# EAGLE schematic display_driver (EAGLE 7.1.0)
REVISION: v0.1
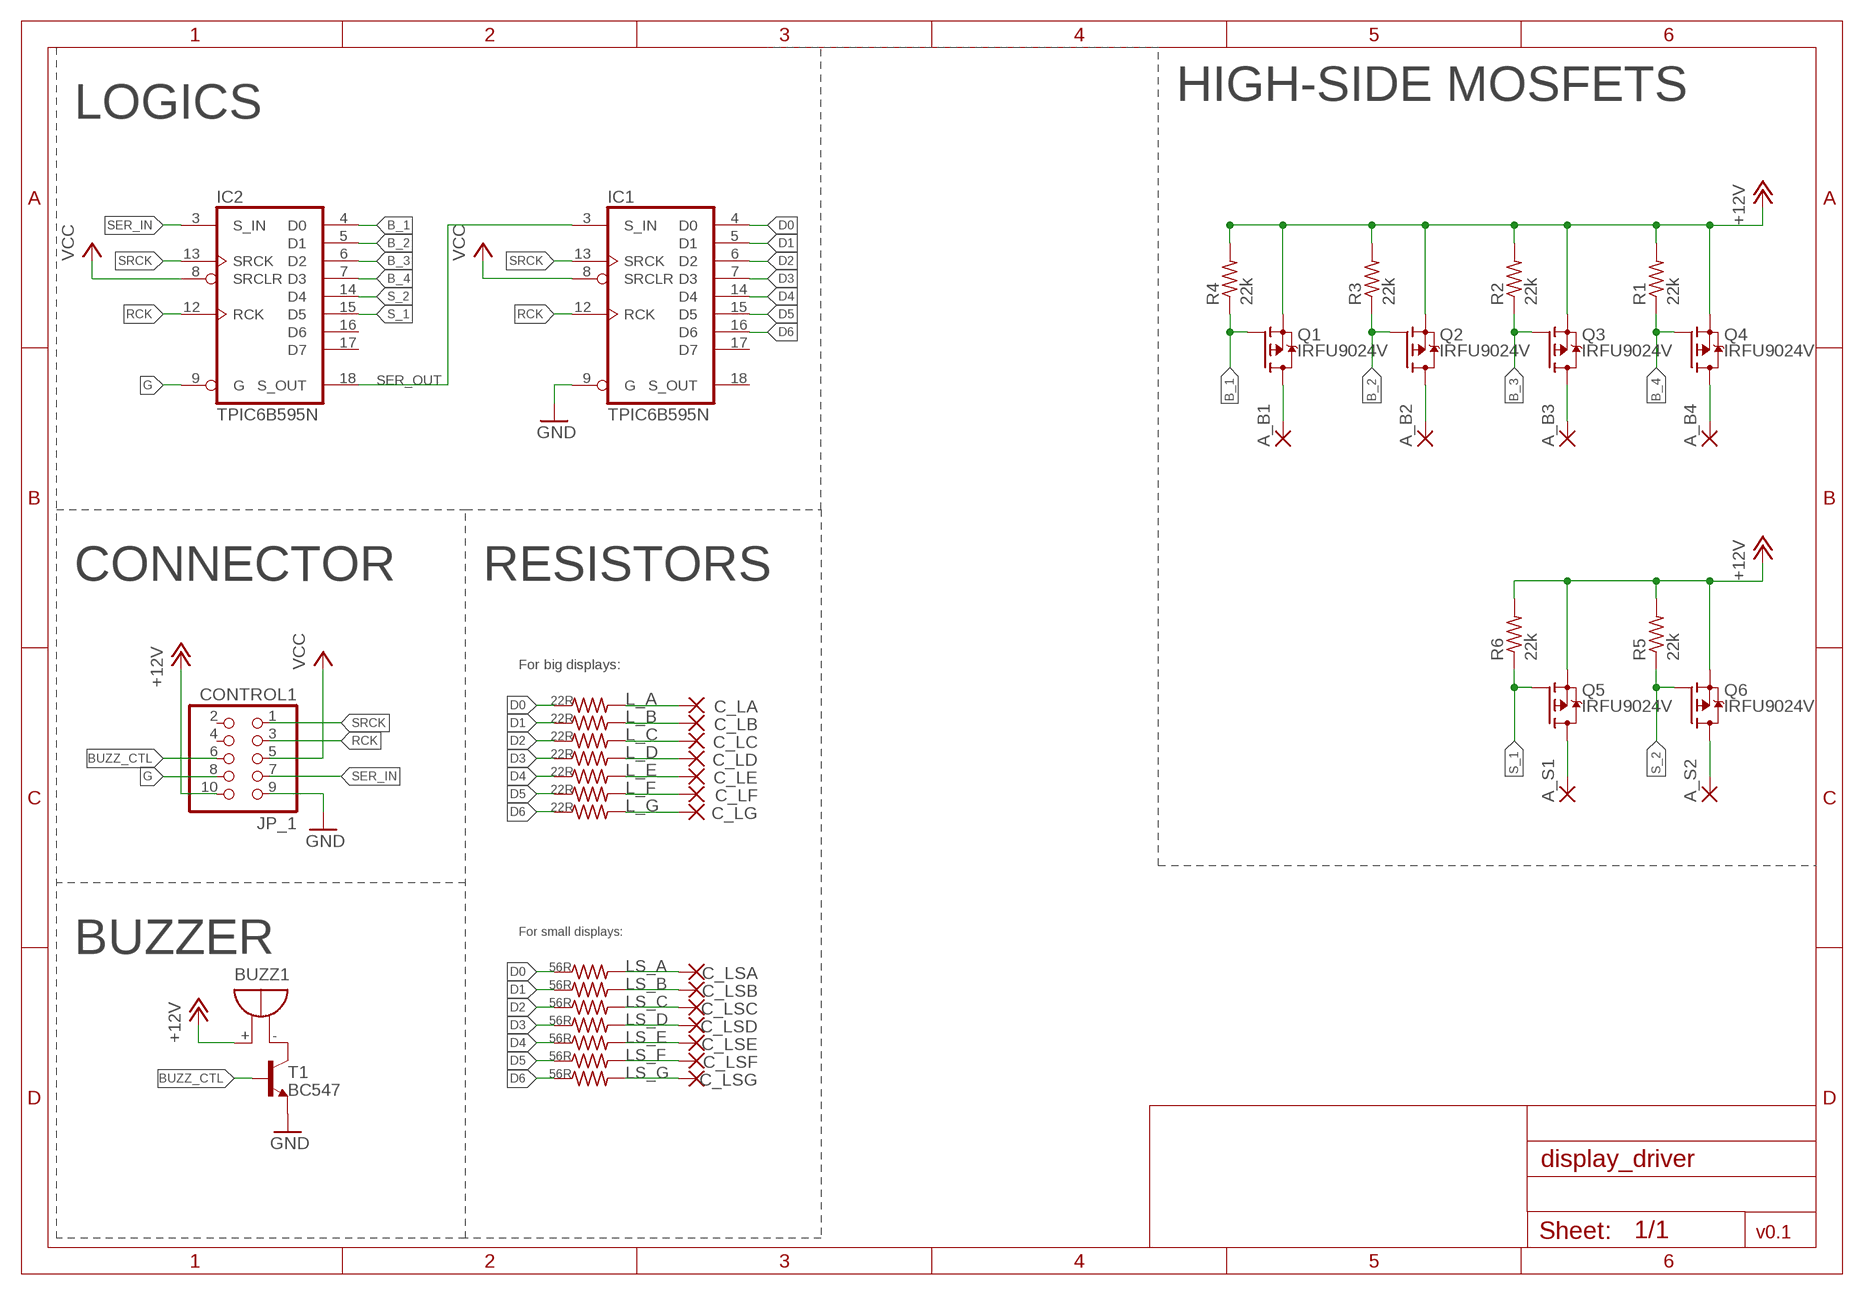
[diagram p0: schematic, sheet 1]

## Parts
A_B1  1,6/0,9  [1,6/0,9]
A_B2  1,6/0,9  [1,6/0,9]
A_B3  1,6/0,9  [1,6/0,9]
A_B4  1,6/0,9  [1,6/0,9]
A_S1  1,6/0,9  [1,6/0,9]
A_S2  1,6/0,9  [1,6/0,9]
BUZZ1  F/BC40  [F/BC40]
C_LA  1,6/0,9  [1,6/0,9]
C_LB  1,6/0,9  [1,6/0,9]
C_LC  1,6/0,9  [1,6/0,9]
C_LD  1,6/0,9  [1,6/0,9]
C_LE  1,6/0,9  [1,6/0,9]
C_LF  1,6/0,9  [1,6/0,9]
C_LG  1,6/0,9  [1,6/0,9]
C_LSA  1,6/0,9  [1,6/0,9]
C_LSB  1,6/0,9  [1,6/0,9]
C_LSC  1,6/0,9  [1,6/0,9]
C_LSD  1,6/0,9  [1,6/0,9]
C_LSE  1,6/0,9  [1,6/0,9]
C_LSF  1,6/0,9  [1,6/0,9]
C_LSG  1,6/0,9  [1,6/0,9]
CONTROL1  JP_1  PINHD-2X5  [2X05]
IC1  TPIC6B595N  [DIL20]
IC2  TPIC6B595N  [DIL20]
Q1  IRFU9024V  [TO251AA-V]
Q2  IRFU9024V  [TO251AA-V]
Q3  IRFU9024V  [TO251AA-V]
Q4  IRFU9024V  [TO251AA-V]
Q5  IRFU9024V  [TO251AA-V]
Q6  IRFU9024V  [TO251AA-V]
R1  22k  R-US_0204/5  [0204/5]
R2  22k  R-US_0204/5  [0204/5]
R3  22k  R-US_0204/5  [0204/5]
R4  22k  R-US_0204/5  [0204/5]
R5  22k  R-US_0204/5  [0204/5]
R6  22k  R-US_0204/5  [0204/5]
R7  22R  R-US_0207/12  [0207/12]
R8  22R  R-US_0207/12  [0207/12]
R9  22R  R-US_0207/12  [0207/12]
R10  22R  R-US_0207/12  [0207/12]
R11  22R  R-US_0207/12  [0207/12]
R12  22R  R-US_0207/12  [0207/12]
R13  22R  R-US_0207/12  [0207/12]
R14  56R  R-US_0207/10  [0207/10]
R15  56R  R-US_0207/10  [0207/10]
R16  56R  R-US_0207/10  [0207/10]
R17  56R  R-US_0207/10  [0207/10]
R18  56R  R-US_0207/10  [0207/10]
R19  56R  R-US_0207/10  [0207/10]
R20  56R  R-US_0207/10  [0207/10]
T1  BC547  [TO92]

## Nets
+12V: BUZZ1.+ CONTROL1.10 Q1.3(S) Q2.3(S) Q3.3(S) Q4.3(S) Q5.3(S) Q6.3(S) R1.2 R2.2 R3.2 R4.2 R5.2 R6.2
B_1: IC2.4(D0) Q1.1(G) R4.1
B_2: IC2.5(D1) Q2.1(G) R3.1
B_3: IC2.6(D2) Q3.1(G) R2.1
B_4: IC2.7(D3) Q4.1(G) R1.1
BUZZ_CTL: CONTROL1.6 T1.2(B)
D0: IC1.4(D0) R7.1 R14.1
D1: IC1.5(D1) R8.1 R15.1
D2: IC1.6(D2) R9.1 R16.1
D3: IC1.7(D3) R10.1 R17.1
D4: IC1.14(D4) R11.1 R18.1
D5: IC1.15(D5) R12.1 R19.1
D6: IC1.16(D6) R13.1 R20.1
G: CONTROL1.8 IC2.9(G)
GND: CONTROL1.9 IC1.9(G) T1.1(E)
L_A: C_LA.1(P) R7.2
L_B: C_LB.1(P) R8.2
L_C: C_LC.1(P) R9.2
L_D: C_LD.1(P) R10.2
L_E: C_LE.1(P) R11.2
L_F: C_LF.1(P) R12.2
L_G: C_LG.1(P) R13.2
LS_A: C_LSA.1(P) R14.2
LS_B: C_LSB.1(P) R15.2
LS_C: C_LSC.1(P) R16.2
LS_D: C_LSD.1(P) R17.2
LS_E: C_LSE.1(P) R18.2
LS_F: C_LSF.1(P) R19.2
LS_G: C_LSG.1(P) R20.2
N$1: A_B1.1(P) Q1.2(D)
N$2: BUZZ1.- T1.3(C)
N$4: A_B2.1(P) Q2.2(D)
N$9: A_B3.1(P) Q3.2(D)
N$12: A_B4.1(P) Q4.2(D)
N$42: A_S2.1(P) Q6.2(D)
N$47: A_S1.1(P) Q5.2(D)
RCK: CONTROL1.3 IC1.12(RCK) IC2.12(RCK)
S_1: IC2.15(D5) Q5.1(G) R6.1
S_2: IC2.14(D4) Q6.1(G) R5.1
SER_IN: CONTROL1.7 IC2.3(S_IN)
SER_OUT: IC1.3(S_IN) IC2.18(S_OUT)
SRCK: CONTROL1.1 IC1.13(SRCK) IC2.13(SRCK)
VCC: CONTROL1.5 IC1.8(SRCLR) IC2.8(SRCLR)
Unconnected: CONTROL1.2 CONTROL1.4 IC1.17(D7) IC1.18(S_OUT) IC2.16(D6) IC2.17(D7)

## Notes on the sheet
- HIGH-SIDE MOSFETS
- LOGICS
- CONNECTOR | RESISTORS
- For big displays:
- For small displays:
- BUZZER

## Power pins joined to a net without a drawn wire
GND: IC1.10(GND) IC1.11(GND) IC1.19(GND) IC2.10(GND) IC2.11(GND) IC2.19(GND)
VCC: IC1.2(VCC) IC2.2(VCC)

## Library data of the parts
A_B1-A_B4 A_S1 A_S2 C_LA C_LB C_LC C_LD C_LE C_LF C_LG C_LSA C_LSB C_LSC C_LSD C_LSE C_LSF C_LSG = wirepad:1,6/0,9: THROUGH-HOLE PAD
BUZZ1 = buzzer:F/BC40: BUZZER Source: Spoerle; OC_FARNELL: unknown; OC_NEWARK: unknown
CONTROL1 = pinhead:PINHD-2X5: PIN HEADER
IC1 IC2 = NumericDisplay:TPIC6B595: 8-bit SHIFT REGISTER, output latch
Q1-Q6 = MINE:IRFU9024: P-CHANNEL MOSFET
R1-R20 = resistor:R-US_: RESISTOR, American symbol
T1 = transistor:BC547: NPN TRANSISTOR